# Altium schematic sheet project1.SchDoc
size A
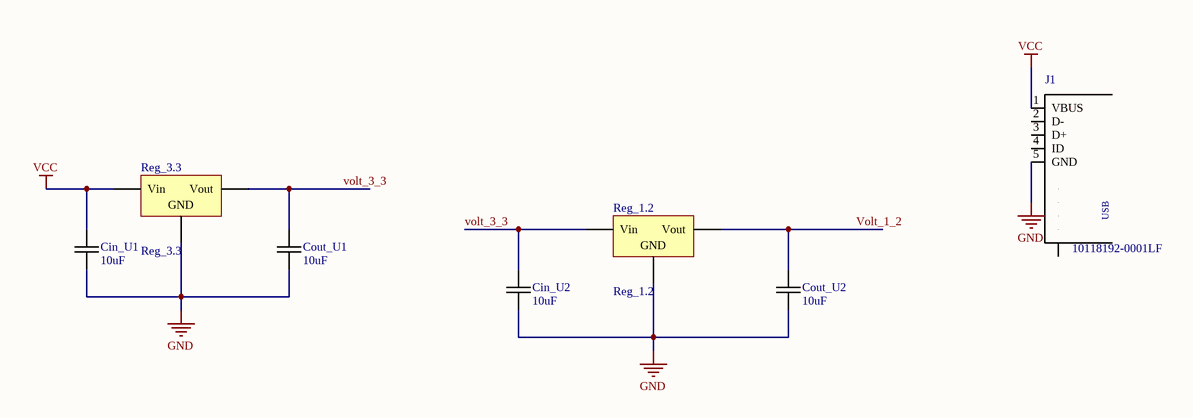
[diagram p0: project1.SchDoc]

## Parts
Cin_U1  10uF  [0805C-GENERIC]
Cin_U2  10uF  [0805C-GENERIC]
Cout_U1  10uF  [0805C-GENERIC]
Cout_U2  10uF  [0805C-GENERIC]
J1  10118192-0001LF  [10118192-0001LF_10118192-0001LF(Primary)]
Reg_1.2  Reg_1.2  [D2PAK_N]
Reg_3.3  Reg_3.3  [D2PAK_N]

## Nets
GND: Cin_U1.2 Cin_U2.2 Cout_U1.2 Cout_U2.2 J1.5(GND) Reg_1.2.2(GND) Reg_3.3.2(GND)
VCC: Cin_U1.1 J1.1(VBUS) Reg_3.3.1(Vin)
Volt_1_2: Cout_U2.1 Reg_1.2.3(Vout)
volt_3_3: Cin_U2.1 Cout_U1.1 Reg_1.2.1(Vin) Reg_3.3.3(Vout)

Not connected (* = marked no-connect by the designer): J1 2(D-) 3(D+) 4(ID) M1(S) M2(S) S1(S) S2(S) S3(S) S4(S)

## Notes on the sheet
- (in symbol 10118192-0001LF) USB

## Library data of the parts
Cin_U1 Cin_U2 Cout_U1 Cout_U2 = 0805C-10UF-16V-X5R-TDK: CAPACITOR 0805 CERAMIC; Manufacturer Part Number: C2012X5R1C106M; Manufacturer: TDK Corporation; REEL: C63; Supplier 1: Digi-Key; Supplier Part Number 1: 445-4115-2-ND
J1 = 10118192-0001LF: Conn Micro USB Type B RCP 5 POS 0.65mm Solder RA SMD 5 Terminal 1 Port T/R; MF: Amphenol; Price: 0.23 USD; MP: 10118192-0001LF; Availability: Good; SnapEDA_Link: https://www.snapeda.com/parts/10118192-0001LF/Amphenol%20Solar/view-part/?ref=snap; Package: None; Value: *
Reg_1.2 Reg_3.3 = Volt Reg: Voltage Regulator; Published: 24-Mar-1999; LatestRevisionDate: 29-May-2009; LatestRevisionNote: IPC-7351 Footprint Added.; PackageReference: D2PAK; Publisher: Altium Limited; PackageDescription: 3-Pin Transistor Outline Package 2.54 mm Pitch, 15.1 mm Lead Span